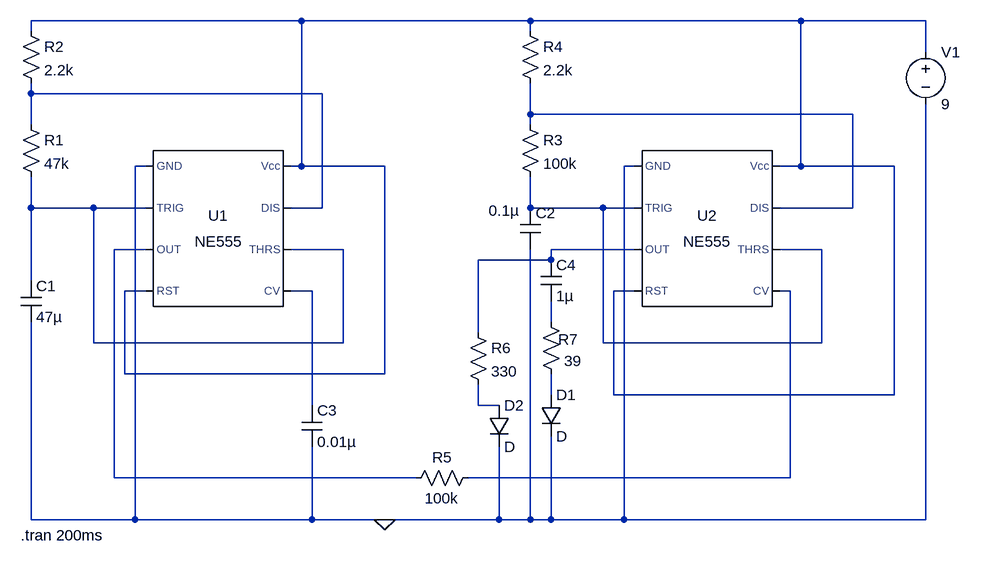
[diagram p0: schematic DingDong.asc]
DingDong.asc, the LTspice schematic file:
Version 4
SHEET 1 936 680
WIRE -80 -288 -496 -288
WIRE 272 -288 -80 -288
WIRE 688 -288 272 -288
WIRE 880 -288 688 -288
WIRE -496 -272 -496 -288
WIRE 272 -272 272 -288
WIRE 880 -240 880 -288
WIRE -496 -176 -496 -192
WIRE -48 -176 -496 -176
WIRE 272 -144 272 -192
WIRE 768 -144 272 -144
WIRE -496 -128 -496 -176
WIRE 272 -128 272 -144
WIRE -320 -64 -336 -64
WIRE -80 -64 -80 -288
WIRE -80 -64 -96 -64
WIRE 48 -64 -80 -64
WIRE 432 -64 416 -64
WIRE 688 -64 688 -288
WIRE 688 -64 656 -64
WIRE 832 -64 688 -64
WIRE -496 0 -496 -48
WIRE -400 0 -496 0
WIRE -320 0 -400 0
WIRE -48 0 -48 -176
WIRE -48 0 -96 0
WIRE 272 0 272 -48
WIRE 384 0 272 0
WIRE 432 0 384 0
WIRE 768 0 768 -144
WIRE 768 0 656 0
WIRE -320 64 -368 64
WIRE -16 64 -96 64
WIRE 432 64 304 64
WIRE 720 64 656 64
WIRE 304 80 304 64
WIRE 304 80 192 80
WIRE -496 112 -496 0
WIRE -320 128 -352 128
WIRE -64 128 -96 128
WIRE 432 128 400 128
WIRE 672 128 656 128
WIRE 304 176 304 144
WIRE 192 192 192 80
WIRE -400 208 -400 0
WIRE -16 208 -16 64
WIRE -16 208 -400 208
WIRE 384 208 384 0
WIRE 720 208 720 64
WIRE 720 208 384 208
WIRE -352 256 -352 128
WIRE 48 256 48 -64
WIRE 48 256 -352 256
WIRE 304 288 304 256
WIRE 400 288 400 128
WIRE 832 288 832 -64
WIRE 832 288 400 288
WIRE -64 304 -64 128
WIRE 192 304 192 272
WIRE 224 304 192 304
WIRE -368 416 -368 64
WIRE 96 416 -368 416
WIRE 672 416 672 128
WIRE 672 416 176 416
WIRE -496 480 -496 176
WIRE -336 480 -336 -64
WIRE -336 480 -496 480
WIRE -64 480 -64 368
WIRE -64 480 -336 480
WIRE 48 480 -64 480
WIRE 224 480 224 368
WIRE 224 480 48 480
WIRE 272 480 272 64
WIRE 272 480 224 480
WIRE 304 480 304 352
WIRE 304 480 272 480
WIRE 416 480 416 -64
WIRE 416 480 304 480
WIRE 880 480 880 -160
WIRE 880 480 416 480
FLAG 48 480 0
SYMBOL Misc\\NE555 -208 32 R0
SYMATTR InstName U1
SYMBOL Misc\\NE555 544 32 R0
SYMATTR InstName U2
SYMBOL res -512 -144 R0
SYMATTR InstName R1
SYMATTR Value 47k
SYMBOL res -512 -288 R0
SYMATTR InstName R2
SYMATTR Value 2.2k
SYMBOL res 256 -144 R0
SYMATTR InstName R3
SYMATTR Value 100k
SYMBOL res 256 -288 R0
SYMATTR InstName R4
SYMATTR Value 2.2k
SYMBOL res 192 400 R90
WINDOW 0 0 56 VBottom 2
WINDOW 3 32 56 VTop 2
SYMATTR InstName R5
SYMATTR Value 100k
SYMBOL cap -512 112 R0
SYMATTR InstName C1
SYMATTR Value 47µ
SYMBOL cap 256 0 R0
WINDOW 3 -48 4 Left 2
SYMATTR Value 0.1µ
SYMATTR InstName C2
SYMBOL cap -80 304 R0
SYMATTR InstName C3
SYMATTR Value 0.01µ
SYMBOL cap 288 80 R0
SYMATTR InstName C4
SYMATTR Value 1µ
SYMBOL voltage 880 -256 R0
WINDOW 123 0 0 Left 0
WINDOW 39 0 0 Left 0
SYMATTR InstName V1
SYMATTR Value 9
SYMBOL diode 288 288 R0
SYMATTR InstName D1
SYMBOL res 176 176 R0
SYMATTR InstName R6
SYMATTR Value 330
SYMBOL res 288 160 R0
WINDOW 0 27 43 Left 2
SYMATTR InstName R7
SYMATTR Value 39
SYMBOL diode 208 304 R0
SYMATTR InstName D2
TEXT -512 504 Left 2 !.tran 200ms

The netlist it stands for:
* DingDong.asc
XU1 0 N004 N006 N001 N008 N004 N002 N001 NE555  ; pins GND TRIG OUT RST CV THRS DIS Vcc
XU2 0 N005 N007 N001 N009 N005 N003 N001 NE555  ; pins GND TRIG OUT RST CV THRS DIS Vcc
R1 N002 N004 47k
R2 N001 N002 2.2k
R3 N003 N005 100k
R4 N001 N003 2.2k
R5 N009 N006 100k
C1 N004 0 47µ
C2 N005 0 0.1µ
C3 N008 0 0.01µ
C4 N007 N010 1µ
V1 N001 0 9
D1 N011 0 D
R6 N007 N012 330
R7 N010 N011 39
D2 N012 0 D
.model D D
.lib standard.dio
.tran 200ms
.lib NE555.sub
.backanno
.end